# Altium schematic sheet MOSFETs and Driver.SchDoc
size B
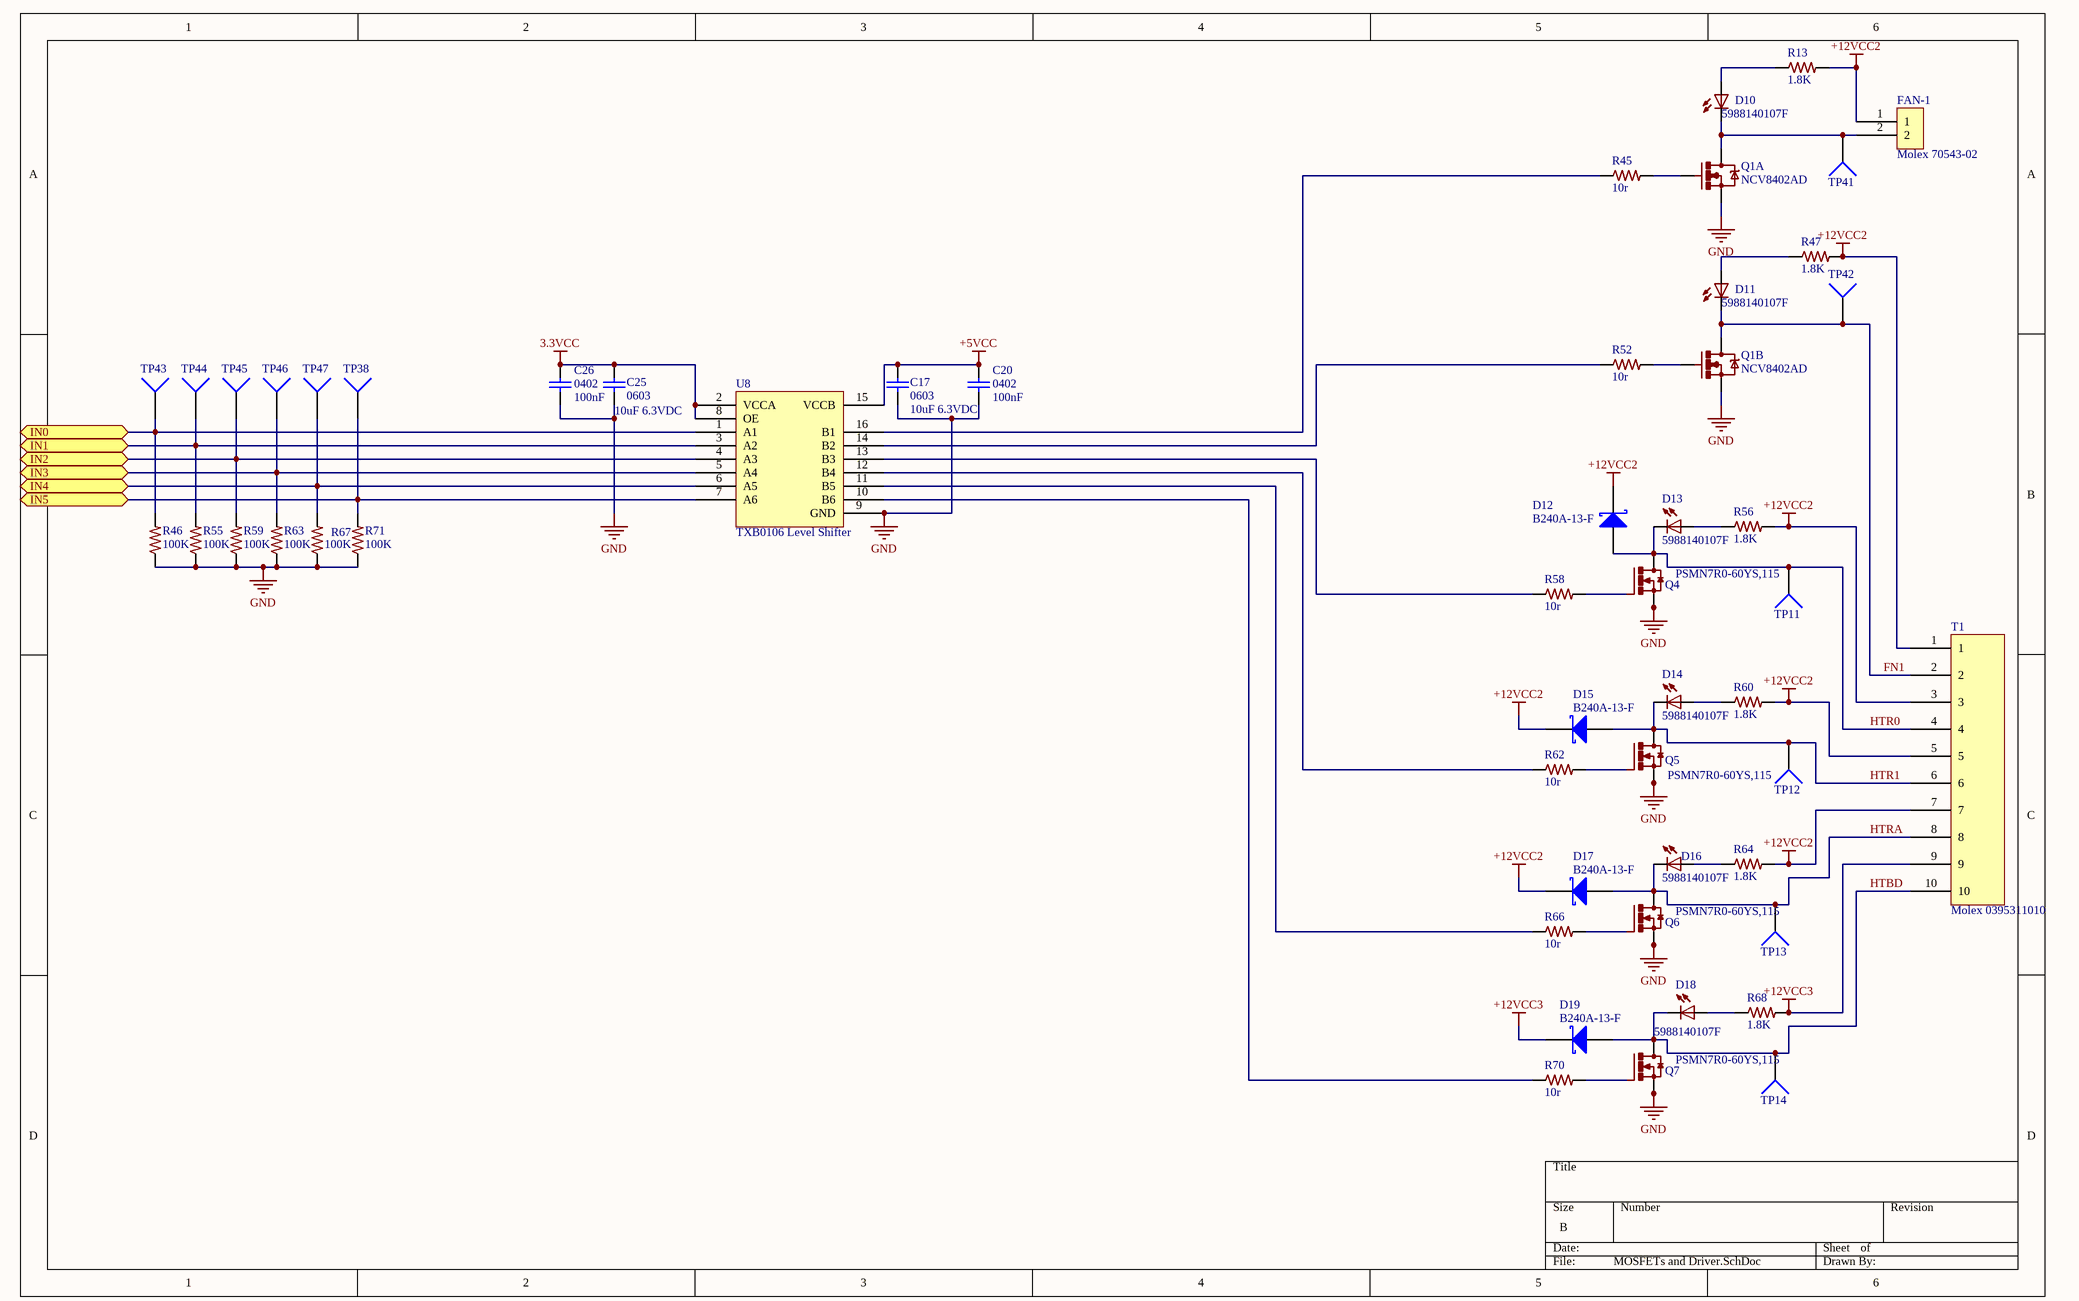
[diagram p0: MOSFETs and Driver.SchDoc]

## Parts
C17  0603  value 10uF 6.3VDC  [C0603]
C20  value 100nF  [C0402]  (hidden comment: 0402)
C25  0603  value 10uF 6.3VDC  [C0603]
C26  value 100nF  [C0402]  (hidden comment: 0402)
D10  5988140107F  [LED2012120]
D11  5988140107F  [LED2012120]
D12  B240A-13-F  [SK310A-TP]
D13  5988140107F  [LED2012120]
D14  5988140107F  [LED2012120]
D15  B240A-13-F  [SK310A-TP]
D16  5988140107F  [LED2012120]
D17  B240A-13-F  [SK310A-TP]
D18  5988140107F  [LED2012120]
D19  B240A-13-F  [SK310A-TP]
FAN-1  Molex 70543-02  [70543-02]
Q1  NCV8402AD  [NCV8402AD-SOIC8]  (parts A,B of 2)
Q4  PSMN7R0-60YS,115  [SOT669]
Q5  PSMN7R0-60YS,115  [SOT669]
Q6  PSMN7R0-60YS,115  [SOT669]
Q7  PSMN7R0-60YS,115  [SOT669]
R13  1.8K  [R0603]
R45  10r  [R0603]
R46  100K  [R0402]
R47  1.8K  [R0603]
R52  10r  [R0603]
R55  100K  [R0402]
R56  1.8K  [R0603]
R58  10r  [R0603]
R59  100K  [R0402]
R60  1.8K  [R0603]
R62  10r  [R0603]
R63  100K  [R0402]
R64  1.8K  [R0603]
R66  10r  [R0603]
R67  100K  [R0402]
R68  1.8K  [R0603]
R70  10r  [R0603]
R71  100K  [R0402]
T1  Molex 0395311010  [MSTBV10]
TP11  TP4  [TP-2]  (value not drawn)
TP12  TP4  [TP-2]  (value not drawn)
TP13  TP4  [TP-2]  (value not drawn)
TP14  TP4  [TP-2]  (value not drawn)
TP38  TP4  [TP-2]  (value not drawn)
TP41  TP4  [TP-2]  (value not drawn)
TP42  TP4  [TP-2]  (value not drawn)
TP43  TP4  [TP-2]  (value not drawn)
TP44  TP4  [TP-2]  (value not drawn)
TP45  TP4  [TP-2]  (value not drawn)
TP46  TP4  [TP-2]  (value not drawn)
TP47  TP4  [TP-2]  (value not drawn)
U8  TXB0106 Level Shifter  [TSOP65P640X120-16N]

## Ports
IN0, IN1, IN2, IN3, IN4, IN5

## Nets
3.3VCC: C25.2 C26.2 U8.2(VCCA) U8.8(OE)
+5VCC: C17.2 C20.2 U8.15(VCCB)
+12VCC2: D12.2(K) D15.2(K) D17.2(K) FAN-1.1 R13.2 R47.2 R56.2 R60.2 R64.2 T1.1 T1.3 T1.5 T1.7
+12VCC3: D19.2(K) R68.2 T1.9
GND: C17.1 C20.1 C25.1 C26.1 Q1.1(S) Q1.3(S) Q4.1(S) Q4.2(S) Q4.3(S) Q5.1(S) Q5.2(S) Q5.3(S) Q6.1(S) Q6.2(S) Q6.3(S) Q7.1(S) Q7.2(S) Q7.3(S) R46.1 R55.1 R59.1 R63.1 R67.1 R71.1 U8.9(GND)
FN1: D11.C Q1.5(D) T1.2 TP42.1
HTBD: D18.C D19.1(A) Q7.MB(D) T1.10 TP14.1
HTR0: D12.1(A) D13.C Q4.MB(D) T1.4 TP11.1
HTR1: D14.C D15.1(A) Q5.MB(D) T1.6 TP12.1
HTRA: D16.C D17.1(A) Q6.MB(D) T1.8 TP13.1
IN0: R46.2 TP43.1 U8.1(A1) ; port IN0
IN1: R55.2 TP44.1 U8.3(A2) ; port IN1
IN2: R59.2 TP45.1 U8.4(A3) ; port IN2
IN3: R63.2 TP46.1 U8.5(A4) ; port IN3
IN4: R67.2 TP47.1 U8.6(A5) ; port IN4
IN5: R71.2 TP38.1 U8.7(A6) ; port IN5
NetD10_A: D10.A R13.1
NetD10_C: D10.C FAN-1.2 Q1.7(D) TP41.1
NetD11_A: D11.A R47.1
NetD13_A: D13.A R56.1
NetD14_A: D14.A R60.1
NetD16_A: D16.A R64.1
NetD18_A: D18.A R68.1
NetQ1_2: Q1.2(G) R45.2
NetQ1_4: Q1.4(G) R52.2
NetQ4_4: Q4.4(G) R58.2
NetQ5_4: Q5.4(G) R62.2
NetQ6_4: Q6.4(G) R66.2
NetQ7_4: Q7.4(G) R70.2
NetR45_1: R45.1 U8.16(B1)
NetR52_1: R52.1 U8.14(B2)
NetR58_1: R58.1 U8.13(B3)
NetR62_1: R62.1 U8.12(B4)
NetR66_1: R66.1 U8.11(B5)
NetR70_1: R70.1 U8.10(B6)

## Library data of the parts
C17 C25 = C1608JB0J106K080AB: CAP CER 10UF 6.3V 10% JB 0603; MFR: TDK; Voltage: 6.3VDC; Published: 10 - Dec - 2014; LatestRevisionDate: 10 - Dec - 2014; Component Type: Chip Capacitor; MFR Part #: C1608JB0J106K080AB; Part Description: CAP CER 10UF 6.3V 10% JB 0603; Mounting Type: SMT 0603; Datasheet: http://www.tdk.com/pdf/TDKMLCCCapRange.pdf; Height: 0.9mm; Tolerance: 10%; Digikey #: 445-11185-1-ND; PackageReference: 0402
C20 C26 = GRM155R71C104KA88D: CAP CER 0.1UF (100nF) 16V 10% X7R 0402; MFR: Murata; Part Description: CAP CER 0.1UF 16V 10% X7R 0402; Published: 10 - Dec - 2014; LatestRevisionDate: 10 - Dec - 2014; LatestRevisionNote: Ultimachine Footprint Added; Publisher: Ultimachine; Component Type: Chip Capacitor; MFR Part #: GRM155R71C104KA88D; Mounting Type: SMT 0402; Datasheet: http://psearch.murata.com/capacitor/product/GRM155R71C104KA88%23.pdf; Height: 0.5 ±0.05mm; Tolerance: 10%; Voltage: 16v; PackageReference: 0402
D10 D11 D13 D14 D16 D18 = 5988140107F: LED 0805 Yellow; LastRevisionNote: ImportComponents; Published: 23-Apr-2014; Publisher: UltiMachine; LastRevisionDate: 23-Apr-2014; VALUE: 5988140107F
D12 D15 D17 D19 = D Schottky: Schottky Diode; Published: 8-Jun-2000; LatestRevisionDate: 17-Jul-2002; LatestRevisionNote: Re-released for DXP Platform.; PackageReference: SMB; Publisher: Altium Limited; PackageDescription: DO-214-AA/SMB; 2 C-Bend Leads; Body 5.3 x 3.6 mm, inc. leads (LxW); Code_JEDEC: DO-214-AA
Q4-Q7 = PSMN7R0-60YS,115: Mosfet N-channel 60V 356A 117W 9.3mOhms; LastRevisionNote: ImportComponents; Published: 23-Apr-2014; Publisher: UltiMachine; LastRevisionDate: 23-Apr-2014; ManufacturerPartNumber: PSMN7R0-60YS,115
R13 R47 R56 R60 R64 R68 = RC0603JR-071K8L: RES 0603 1.8K 100mW 5%; LastRevisionNote: ImportComponents; Published: 23-Apr-2014; Publisher: UltiMachine; LastRevisionDate: 23-Apr-2014; ManufacturerPartNumber: RC0603JR-071K8L; VALUE: 1.8K
R45 R52 R58 R62 R66 R70 = CRCW060310R0FKEA: RES 0603 10r 100mW 1%; LastRevisionNote: ImportComponents; Published: 23-Apr-2014; Publisher: UltiMachine; LastRevisionDate: 23-Apr-2014; ManufacturerPartNumber: CRCW060310R0FKEA; VALUE: 10r
R46 R55 R59 R63 R67 R71 = RC1005F104CS: RES SMD 100K OHM 1% 1/16W 0402; Manufacturer: Samsung; LastRevisionNote: ImportComponents; Digilkey #: 1276-3432-1-ND; Published: 23-Apr-2014; Publisher: UltiMachine; LastRevisionDate: 23-Apr-2014; ManufacturerPartNumber: RC1005F104CS; VALUE: 100K
T1 = 0395311010 - Molex 10 Position Connector: MSBTV10 10 port connector same as RAMBo; Manufacture: Molex; Mounting Type: Through Hole; Part Number: 0395311010; Datasheet: http://www.molex.com/pdm_docs/sd/395311002_sd.pdf; Status: Active; Pin Count: 10 , 5.08mm pitch; Height: *; Lead Free: YES; Cost: 2.46000
TP11-TP14 TP38 TP41-TP47 = Socket: LatestRevisionDate: 17-Jul-2002; LatestRevisionNote: Re-released for DXP Platform.; Publisher: Altium Limited
U8 = TXB0106: TXB0106 - Bidriectional Opendrain/pushpull level shift